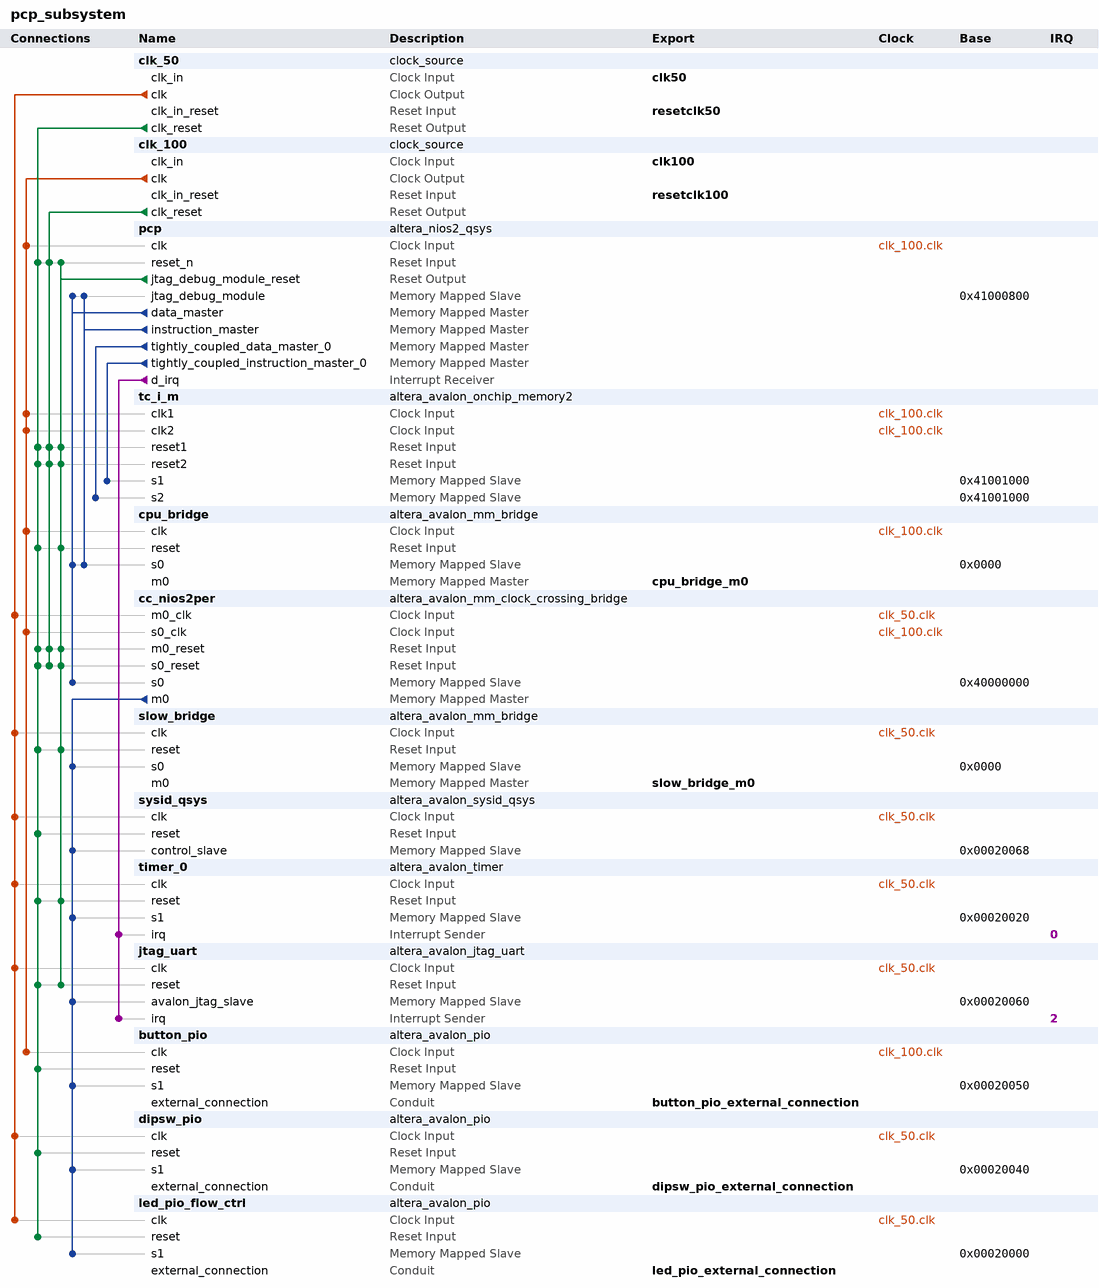
[diagram p0: system contents]
# Platform Designer (Qsys) system pcp_subsystem, Cyclone V 5CSXFC6D6F31C6
# Parameters at their usual value, and those the tool derives, are not listed.
package require -exact qsys 13.1
create_system pcp_subsystem
set_project_property DEVICE_FAMILY {Cyclone V}
set_project_property DEVICE 5CSXFC6D6F31C6

add_instance clk_50 clock_source 13.1
set_instance_parameter_value clk_50 clockFrequency 50000000

add_instance clk_100 clock_source 13.1
set_instance_parameter_value clk_100 clockFrequency 100000000

add_instance pcp altera_nios2_qsys 13.1
set_instance_parameter_value pcp mmu_autoAssignTlbPtrSz false
set_instance_parameter_value pcp cpuID 2
set_instance_parameter_value pcp resetSlave tc_i_m.s1
set_instance_parameter_value pcp mmu_TLBMissExcSlave tc_i_m.s1
set_instance_parameter_value pcp exceptionSlave tc_i_m.s1
set_instance_parameter_value pcp breakSlave pcp.jtag_debug_module
set_instance_parameter_value pcp impl Fast
set_instance_parameter_value pcp icache_size 32768
set_instance_parameter_value pcp icache_numTCIM 1
set_instance_parameter_value pcp dcache_size 32768
set_instance_parameter_value pcp dcache_numTCDM 1

add_instance tc_i_m altera_avalon_onchip_memory2 13.1
set_instance_parameter_value tc_i_m dataWidth 32
set_instance_parameter_value tc_i_m dualPort true
set_instance_parameter_value tc_i_m initMemContent true
set_instance_parameter_value tc_i_m initializationFileName onchip_mem.hex
set_instance_parameter_value tc_i_m memorySize 1024

add_instance cpu_bridge altera_avalon_mm_bridge 13.1
set_instance_parameter_value cpu_bridge DATA_WIDTH 32
set_instance_parameter_value cpu_bridge ADDRESS_WIDTH 30
set_instance_parameter_value cpu_bridge ADDRESS_UNITS SYMBOLS
set_instance_parameter_value cpu_bridge MAX_BURST_SIZE 8
set_instance_parameter_value cpu_bridge MAX_PENDING_RESPONSES 4

add_instance cc_nios2per altera_avalon_mm_clock_crossing_bridge 13.1
set_instance_parameter_value cc_nios2per DATA_WIDTH 32
set_instance_parameter_value cc_nios2per ADDRESS_WIDTH 20
set_instance_parameter_value cc_nios2per MAX_BURST_SIZE 1
set_instance_parameter_value cc_nios2per COMMAND_FIFO_DEPTH 4
set_instance_parameter_value cc_nios2per RESPONSE_FIFO_DEPTH 4
set_instance_parameter_value cc_nios2per MASTER_SYNC_DEPTH 2
set_instance_parameter_value cc_nios2per SLAVE_SYNC_DEPTH 2

add_instance slow_bridge altera_avalon_mm_bridge 13.1
set_instance_parameter_value slow_bridge DATA_WIDTH 32
set_instance_parameter_value slow_bridge ADDRESS_WIDTH 17
set_instance_parameter_value slow_bridge ADDRESS_UNITS SYMBOLS
set_instance_parameter_value slow_bridge MAX_PENDING_RESPONSES 4

add_instance sysid_qsys altera_avalon_sysid_qsys 13.1
set_instance_parameter_value sysid_qsys id 305419896

add_instance timer_0 altera_avalon_timer 13.1
set_instance_parameter_value timer_0 period 1
set_instance_parameter_value timer_0 periodUnits MSEC

add_instance jtag_uart altera_avalon_jtag_uart 13.1
set_instance_parameter_value jtag_uart simInteractiveOptions INTERACTIVE_ASCII_OUTPUT

add_instance button_pio altera_avalon_pio 13.1
set_instance_parameter_value button_pio bitClearingEdgeCapReg true
set_instance_parameter_value button_pio captureEdge true
set_instance_parameter_value button_pio direction Input
set_instance_parameter_value button_pio edgeType FALLING
set_instance_parameter_value button_pio irqType EDGE
set_instance_parameter_value button_pio width 2

add_instance dipsw_pio altera_avalon_pio 13.1
set_instance_parameter_value dipsw_pio bitClearingEdgeCapReg true
set_instance_parameter_value dipsw_pio captureEdge true
set_instance_parameter_value dipsw_pio direction Input
set_instance_parameter_value dipsw_pio edgeType ANY
set_instance_parameter_value dipsw_pio irqType EDGE
set_instance_parameter_value dipsw_pio width 4

add_instance led_pio_flow_ctrl altera_avalon_pio 13.1
set_instance_parameter_value led_pio_flow_ctrl bitModifyingOutReg true
set_instance_parameter_value led_pio_flow_ctrl direction InOut
set_instance_parameter_value led_pio_flow_ctrl width 4

# connections
add_connection clk_50.clk cc_nios2per.m0_clk clock
add_connection clk_50.clk dipsw_pio.clk clock
add_connection clk_50.clk jtag_uart.clk clock
add_connection clk_50.clk led_pio_flow_ctrl.clk clock
add_connection clk_50.clk slow_bridge.clk clock
add_connection clk_50.clk sysid_qsys.clk clock
add_connection clk_50.clk timer_0.clk clock
add_connection clk_100.clk button_pio.clk clock
add_connection clk_100.clk cc_nios2per.s0_clk clock
add_connection clk_100.clk cpu_bridge.clk clock
add_connection clk_100.clk pcp.clk clock
add_connection clk_100.clk tc_i_m.clk1 clock
add_connection clk_100.clk tc_i_m.clk2 clock
add_connection clk_50.clk_reset button_pio.reset reset
add_connection clk_50.clk_reset cc_nios2per.m0_reset reset
add_connection clk_50.clk_reset cc_nios2per.s0_reset reset
add_connection clk_50.clk_reset cpu_bridge.reset reset
add_connection clk_50.clk_reset dipsw_pio.reset reset
add_connection clk_50.clk_reset jtag_uart.reset reset
add_connection clk_50.clk_reset led_pio_flow_ctrl.reset reset
add_connection clk_50.clk_reset pcp.reset_n reset
add_connection clk_50.clk_reset slow_bridge.reset reset
add_connection clk_50.clk_reset sysid_qsys.reset reset
add_connection clk_50.clk_reset tc_i_m.reset1 reset
add_connection clk_50.clk_reset tc_i_m.reset2 reset
add_connection clk_50.clk_reset timer_0.reset reset
add_connection clk_100.clk_reset cc_nios2per.m0_reset reset
add_connection clk_100.clk_reset cc_nios2per.s0_reset reset
add_connection clk_100.clk_reset pcp.reset_n reset
add_connection clk_100.clk_reset tc_i_m.reset1 reset
add_connection clk_100.clk_reset tc_i_m.reset2 reset
add_connection pcp.jtag_debug_module_reset cc_nios2per.m0_reset reset
add_connection pcp.jtag_debug_module_reset cc_nios2per.s0_reset reset
add_connection pcp.jtag_debug_module_reset cpu_bridge.reset reset
add_connection pcp.jtag_debug_module_reset jtag_uart.reset reset
add_connection pcp.jtag_debug_module_reset pcp.reset_n reset
add_connection pcp.jtag_debug_module_reset slow_bridge.reset reset
add_connection pcp.jtag_debug_module_reset tc_i_m.reset1 reset
add_connection pcp.jtag_debug_module_reset tc_i_m.reset2 reset
add_connection pcp.jtag_debug_module_reset timer_0.reset reset
add_connection cc_nios2per.m0 button_pio.s1 avalon
set_connection_parameter_value cc_nios2per.m0/button_pio.s1 baseAddress 0x00020050
add_connection cc_nios2per.m0 dipsw_pio.s1 avalon
set_connection_parameter_value cc_nios2per.m0/dipsw_pio.s1 baseAddress 0x00020040
add_connection cc_nios2per.m0 jtag_uart.avalon_jtag_slave avalon
set_connection_parameter_value cc_nios2per.m0/jtag_uart.avalon_jtag_slave baseAddress 0x00020060
add_connection cc_nios2per.m0 led_pio_flow_ctrl.s1 avalon
set_connection_parameter_value cc_nios2per.m0/led_pio_flow_ctrl.s1 baseAddress 0x00020000
add_connection cc_nios2per.m0 slow_bridge.s0 avalon
set_connection_parameter_value cc_nios2per.m0/slow_bridge.s0 baseAddress 0x0000
add_connection cc_nios2per.m0 sysid_qsys.control_slave avalon
set_connection_parameter_value cc_nios2per.m0/sysid_qsys.control_slave baseAddress 0x00020068
add_connection cc_nios2per.m0 timer_0.s1 avalon
set_connection_parameter_value cc_nios2per.m0/timer_0.s1 baseAddress 0x00020020
add_connection pcp.data_master cc_nios2per.s0 avalon
set_connection_parameter_value pcp.data_master/cc_nios2per.s0 baseAddress 0x40000000
add_connection pcp.data_master cpu_bridge.s0 avalon
set_connection_parameter_value pcp.data_master/cpu_bridge.s0 baseAddress 0x0000
add_connection pcp.data_master pcp.jtag_debug_module avalon
set_connection_parameter_value pcp.data_master/pcp.jtag_debug_module baseAddress 0x41000800
add_connection pcp.instruction_master cpu_bridge.s0 avalon
set_connection_parameter_value pcp.instruction_master/cpu_bridge.s0 baseAddress 0x0000
add_connection pcp.instruction_master pcp.jtag_debug_module avalon
set_connection_parameter_value pcp.instruction_master/pcp.jtag_debug_module baseAddress 0x41000800
add_connection pcp.tightly_coupled_data_master_0 tc_i_m.s2 avalon
set_connection_parameter_value pcp.tightly_coupled_data_master_0/tc_i_m.s2 baseAddress 0x41001000
add_connection pcp.tightly_coupled_instruction_master_0 tc_i_m.s1 avalon
set_connection_parameter_value pcp.tightly_coupled_instruction_master_0/tc_i_m.s1 baseAddress 0x41001000
add_connection pcp.d_irq jtag_uart.irq interrupt
set_connection_parameter_value pcp.d_irq/jtag_uart.irq irqNumber 2
add_connection pcp.d_irq timer_0.irq interrupt
set_connection_parameter_value pcp.d_irq/timer_0.irq irqNumber 0

# exported interfaces
add_interface clk50 clock sink
set_interface_property clk50 EXPORT_OF clk_50.clk_in
add_interface resetclk50 reset sink
set_interface_property resetclk50 EXPORT_OF clk_50.clk_in_reset
add_interface led_pio_external_connection conduit end
set_interface_property led_pio_external_connection EXPORT_OF led_pio_flow_ctrl.external_connection
add_interface dipsw_pio_external_connection conduit end
set_interface_property dipsw_pio_external_connection EXPORT_OF dipsw_pio.external_connection
add_interface button_pio_external_connection conduit end
set_interface_property button_pio_external_connection EXPORT_OF button_pio.external_connection
add_interface clk100 clock sink
set_interface_property clk100 EXPORT_OF clk_100.clk_in
add_interface cpu_bridge_m0 avalon master
set_interface_property cpu_bridge_m0 EXPORT_OF cpu_bridge.m0
add_interface resetclk100 reset sink
set_interface_property resetclk100 EXPORT_OF clk_100.clk_in_reset
add_interface slow_bridge_m0 avalon master
set_interface_property slow_bridge_m0 EXPORT_OF slow_bridge.m0

set_interconnect_requirement {$system} qsys_mm.clockCrossingAdapter HANDSHAKE
set_interconnect_requirement {$system} qsys_mm.maxAdditionalLatency 1
set_interconnect_requirement {$system} qsys_mm.insertDefaultSlave false

save_system pcp_subsystem.qsys
